# Altium schematic sheet 0_10V_Conv.SchDoc
size A3; SheetNumber: 8; SheetTotal: 15
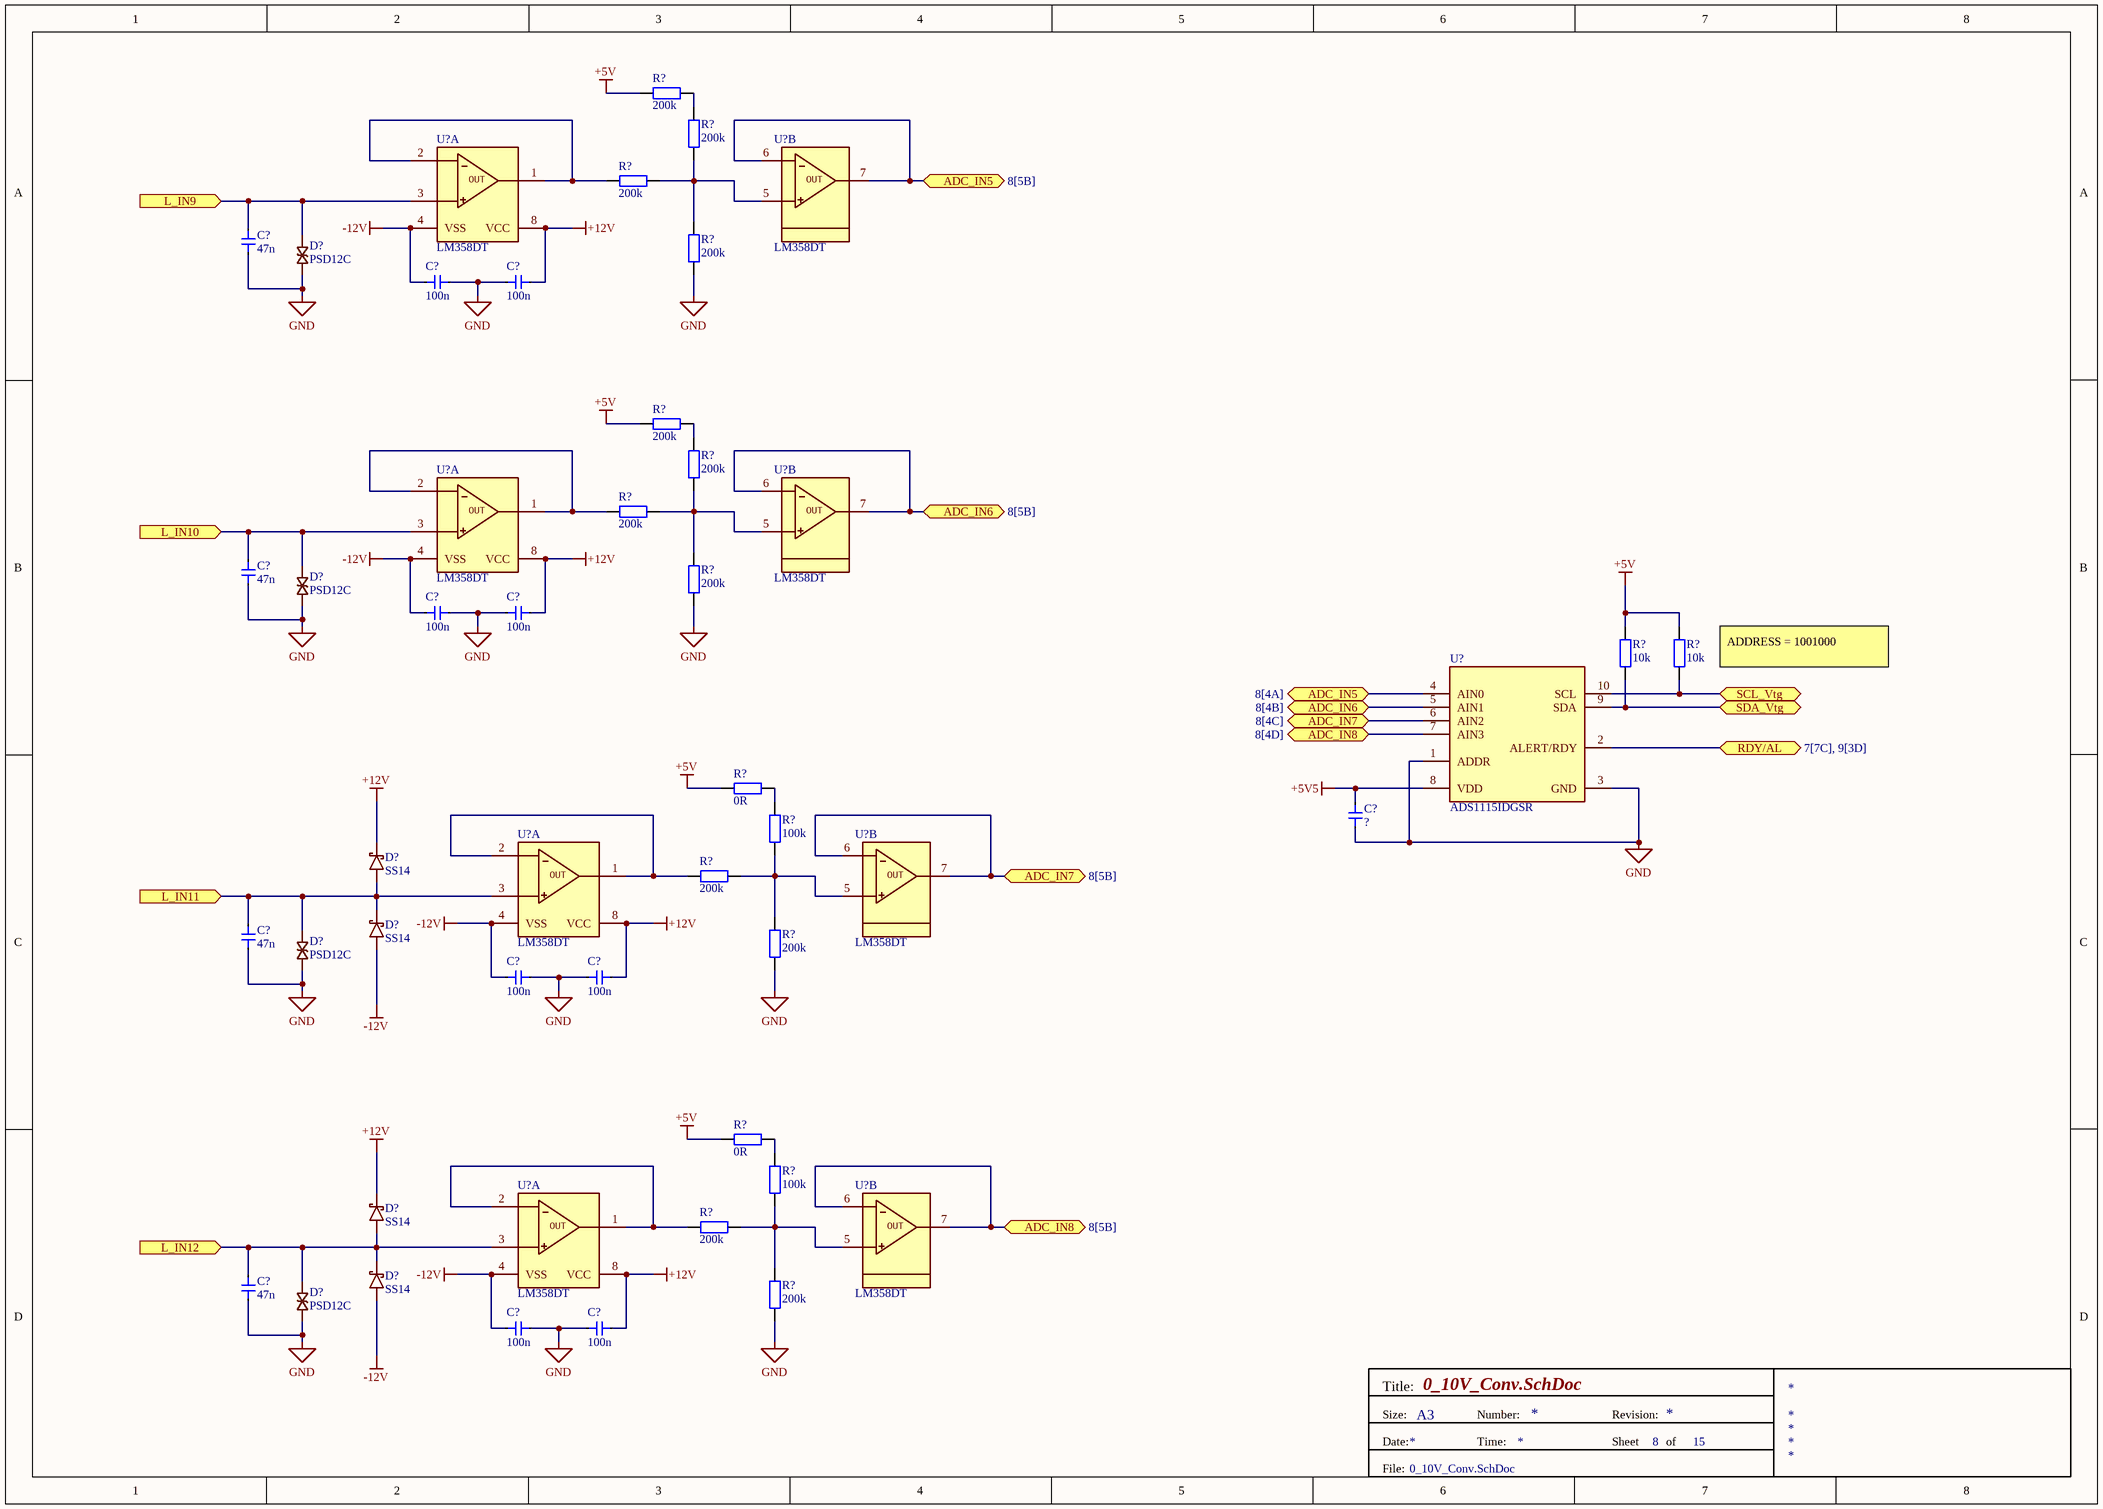
[diagram p0: 0_10V_Conv.SchDoc]

## Parts
(Parts that share a designator on the sheet are numbered #1, #2 ... from top to bottom, then left to right.)
C?#1  47n  [Cap 0603]
C?#2  100n  [Cap 0603]
C?#3  100n  [Cap 0603]
C?#4  47n  [Cap 0603]
C?#5  100n  [Cap 0603]
C?#6  100n  [Cap 0603]
C?#7  ?  [Cap 0603]
C?#8  47n  [Cap 0603]
C?#9  100n  [Cap 0603]
C?#10  100n  [Cap 0603]
C?#11  47n  [Cap 0603]
C?#12  100n  [Cap 0603]
C?#13  100n  [Cap 0603]
D?#1  PSD12C  [SOD-323]
D?#2  PSD12C  [SOD-323]
D?#3  SS14  [SS14]
D?#4  SS14  [SS14]
D?#5  PSD12C  [SOD-323]
D?#6  SS14  [SS14]
D?#7  SS14  [SS14]
D?#8  PSD12C  [SOD-323]
R?#1  200k  [tro smd 0603]
R?#2  200k  [tro smd 0603]
R?#3  200k  [tro smd 0603]
R?#4  200k  [tro smd 0603]
R?#5  200k  [tro smd 0603]
R?#6  200k  [tro smd 0603]
R?#7  200k  [tro smd 0603]
R?#8  200k  [tro smd 0603]
R?#9  10k  [tro smd 0603]
R?#10  10k  [tro smd 0603]
R?#11  0R  [tro smd 0603]
R?#12  100k  [tro smd 0603]
R?#13  200k  [tro smd 0603]
R?#14  200k  [tro smd 0603]
R?#15  0R  [tro smd 0603]
R?#16  100k  [tro smd 0603]
R?#17  200k  [tro smd 0603]
R?#18  200k  [tro smd 0603]
U?#1  LM358DT  [SOIC8]  (part A of 2)
U?#2  LM358DT  [SOIC8]  (part B of 2)
U?#3  LM358DT  [SOIC8]  (part A of 2)
U?#4  LM358DT  [SOIC8]  (part B of 2)
U?#5  ADS1115IDGSR  [AD8237ARMZ-R7]
U?#6  LM358DT  [SOIC8]  (part A of 2)
U?#7  LM358DT  [SOIC8]  (part B of 2)
U?#8  LM358DT  [SOIC8]  (part A of 2)
U?#9  LM358DT  [SOIC8]  (part B of 2)

## Ports
ADC_IN5 (bidir, see 8[4A]), ADC_IN5 (bidir, see 8[5B]), ADC_IN6 (bidir, see 8[4B]), ADC_IN6 (bidir, see 8[5B]), ADC_IN7 (bidir, see 8[4C]), ADC_IN7 (bidir, see 8[5B]), ADC_IN8 (bidir, see 8[4D]), ADC_IN8 (bidir, see 8[5B]), L_IN9 (in), L_IN10 (in), L_IN11 (in), L_IN12 (in), RDY/AL (bidir, see 7[7C], 9[3D]), SCL_Vtg (bidir), SDA_Vtg (bidir)

## Nets
+5V: R?#1.1 R?#5.1 R?#9.2 R?#10.2 R?#11.1 R?#15.1
+5V5: C?#7.2 U?#5.8(VDD)
+12V: C?#3.2 C?#6.2 C?#10.2 C?#13.2 D?#3.2 D?#6.2 U?#1.8(VCC) U?#3.8(VCC) U?#6.8(VCC) U?#8.8(VCC)
-12V: C?#2.1 C?#5.1 C?#9.1 C?#12.1 D?#4.1 D?#7.1 U?#1.4(VSS) U?#3.4(VSS) U?#6.4(VSS) U?#8.4(VSS)
GND: C?#1.2 C?#2.2 C?#3.1 C?#4.2 C?#5.2 C?#6.1 C?#7.1 C?#8.2 C?#9.2 C?#10.1 C?#11.2 C?#12.2 C?#13.1 D?#1.A D?#2.A D?#5.A D?#8.A R?#4.2 R?#8.2 R?#14.2 R?#18.2 U?#5.1(ADDR) U?#5.3(GND)
ADC_IN5: U?#2.6 U?#2.7 U?#5.4(AIN0) ; port ADC_IN5
ADC_IN6: U?#4.6 U?#4.7 U?#5.5(AIN1) ; port ADC_IN6
ADC_IN7: U?#5.6(AIN2) U?#7.6 U?#7.7 ; port ADC_IN7
ADC_IN8: U?#5.7(AIN3) U?#9.6 U?#9.7 ; port ADC_IN8
L_IN9: C?#1.1 D?#1.C U?#1.3 ; port L_IN9
L_IN10: C?#4.1 D?#2.C U?#3.3 ; port L_IN10
L_IN11: C?#8.1 D?#3.1 D?#4.2 D?#5.C U?#6.3 ; port L_IN11
L_IN12: C?#11.1 D?#6.1 D?#7.2 D?#8.C U?#8.3 ; port L_IN12
RDY/AL: U?#5.2(ALERT/RDY) ; port RDY/AL
SCL_Vtg: R?#10.1 U?#5.10(SCL) ; port SCL_Vtg
SDA_Vtg: R?#9.1 U?#5.9(SDA) ; port SDA_Vtg
NetR?#1_2: R?#1.2 R?#2.1
NetR?#2_2: R?#2.2 R?#3.2 R?#4.1 U?#2.5
NetR?#3_1: R?#3.1 U?#1.1 U?#1.2
NetR?#5_2: R?#5.2 R?#6.1
NetR?#6_2: R?#6.2 R?#7.2 R?#8.1 U?#4.5
NetR?#7_1: R?#7.1 U?#3.1 U?#3.2
NetR?#11_2: R?#11.2 R?#12.1
NetR?#12_2: R?#12.2 R?#13.2 R?#14.1 U?#7.5
NetR?#13_1: R?#13.1 U?#6.1 U?#6.2
NetR?#15_2: R?#15.2 R?#16.1
NetR?#16_2: R?#16.2 R?#17.2 R?#18.1 U?#9.5
NetR?#17_1: R?#17.1 U?#8.1 U?#8.2

## Notes on the sheet
- (near R?#10) ADDRESS = 1001000
- Title:
- Size:
- Date:
- A3
- Number:
- Time:
- Revision:
- Sheet
- of
- File:
- (in symbol LM358DT, part A) OUT
- (in symbol LM358DT, part B) OUT

## Library data of the parts
C?#1-C?#13 = Cap 0603: Capacitor SMD 0603
D?#1 D?#2 D?#5 D?#8 = PSD12C: Package SOD323, Diode TVS, 50 pF, 29.5 V
R?#1-R?#18 = Tro 0603 1% 10k: Dán; Don_Vi: Con; So_Chan: 2; Ten_Linh_Kien: Trở 0603 1% 10k; Ma_Hang: MH006333; Chung_Loai: Dán; Kieu_Chan: *
U?#1-U?#4 U?#6-U?#9 = LM358DT: Điện áp: 2V ~ 36V, ± 1V ~ 18V, Số chân: 8
U?#5 = ADS1115IDGSR: ADC, Delta-Sigma, 16-Bit, 1 Func, 4 Channel, Serial Access, PDSO10; Manufacturer: Texas Instruments; Package Body Material: Plastic; Max Input Voltage (AC): 4.096V; Min Input Voltage (AC): -4.096V; Conversion Time-Max: 1.162us; Linearity Error-Max (EL): 0.0015%; Number of Analog In Channels: 4; Number of Bits: 16; Channels: 1; Output Bit Code: 2''S COMPLEMENT BINARY; Package Equivalence Code: TSSOP10,.19,20; Power Supplies: 3.3V; Sample Rate (Hz): 860kHz; Qualification Status: Not Qualified; Supplier: Digikey; Supplier Part Number: 296-38849-1-ND; Manufacturer Part Number: ADS1115IDGSR; RoHS: Yes; Category: Analog to Digital Converters (ADCs); Stock: 3443; Pricing: 1=4.96, 10=3.644, 25=3.3144, 100=2.952, 250=2.77904, 500=2.67478, 1000=2.58892 (USD); Case/Package: TSSOP; Pins: 10; Package Shape: Square; Terminal Finish: Nickel; Min Operating Temperature: -40°C; Max Operating Temperature: 125°C; JESD-609 Code: e4; Output Format: Serial; Converter Type: DELTA-SIGMA; JESD-30 Code: S-PDSO-G10; Moisture Sensitivity Level: 2; Package Style: SMALL OUTLINE, THIN PROFILE, SHRINK PITCHMeter; Peak Reflow Temperature (Cel): 260°C; Nominal Supply Voltage: 3.3V; Surface Mount: Yes; Terminal Form: Gull Wing; Terminal Position: DUAL; Length: 3mm; Width: 3mm; Height - Seated (Max): 1.1mm; Terminal Pitch: 0.5mm; Temperature Grade: AUTOMOTIVE; Reach SVHC Compliant: Yes; RoHS Compliant: Yes; ComponentLink1URL: https://www.ti.com:443/lit/ds/symlink/ads1113.pdf?src-supplier=IHS+Markit; ComponentLink1Description: https://www.ti.com:443/lit/ds/symlink/ads1113.pdf?src-supplier=IHS+Markit; ComponentLink2URL: https://datasheet.ciiva.com/4031/47725463s8438921n7713-4031028.pdf?src-supplier=Arrow+Electronics; ComponentLink2Description: https://datasheet.ciiva.com/4031/47725463s8438921n7713-4031028.pdf?src-supplier=Arrow+Electronics